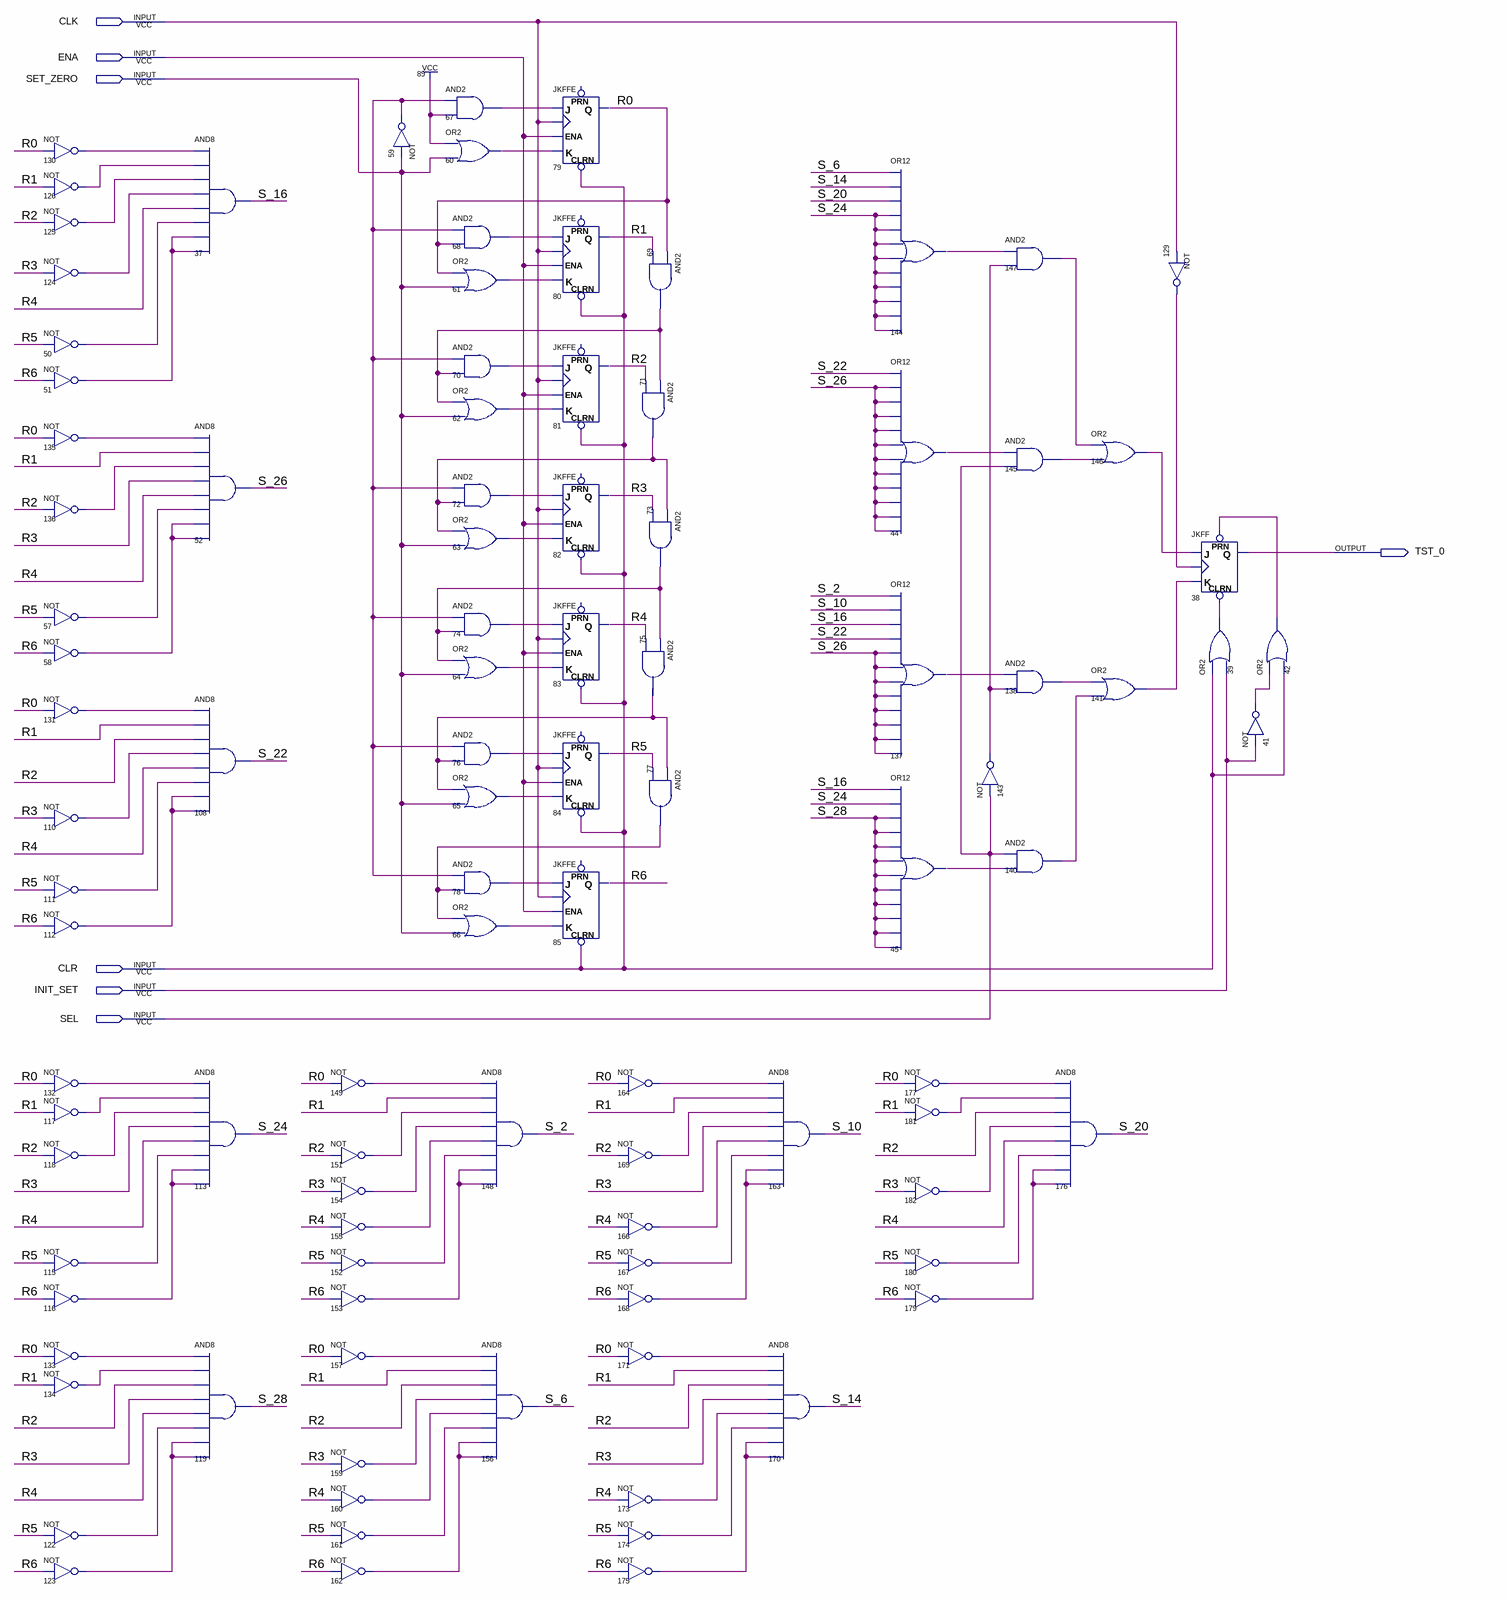
[diagram p0: schematic sheet]
// Quartus schematic test_seq2.bdf as structural Verilog: 101 symbols, 7 pins
module test_seq2 (
  input  CLK,
  input  ENA,
  input  SET_ZERO,
  input  CLR,
  input  INIT_SET,
  input  SEL,
  output TST_0
);

  wire n39_out, n41_out, n42_out, n44_out, n45_out, n50_out, n51_out, n57_out, n58_out, n59_out, n60_out,
       n61_out, n62_out, n63_out, n64_out, n65_out, n66_out, n67_out, n68_out, n69_out, n70_out, n71_out,
       n72_out, n73_out, n74_out, n75_out, n76_out, n77_out, n78_out, n110_out, n111_out, n112_out, n115_out,
       n116_out, n117_out, n118_out, n122_out, n123_out, n124_out, n125_out, n126_out, n129_out, n130_out,
       n131_out, n132_out, n133_out, n134_out, n135_out, n136_out, n137_out, n138_out, n140_out, n141_out,
       n143_out, n144_out, n145_out, n146_out, n147_out, n149_out, n151_out, n152_out, n153_out, n154_out,
       n155_out, n157_out, n159_out, n160_out, n161_out, n162_out, n164_out, n166_out, n167_out, n168_out,
       n169_out, n171_out, n173_out, n174_out, n175_out, n177_out, n179_out, n180_out, n181_out, n182_out,
       R0, R1, R2, R3, R4, R5, R6, S_2, S_6, S_10, S_14, S_16, S_20, S_22, S_24, S_26, S_28;

  not u_130 (n130_out, R0);
  not u_126 (n126_out, R1);
  not u_125 (n125_out, R2);
  not u_124 (n124_out, R3);
  not u_50 (n50_out, R5);
  not u_51 (n51_out, R6);
  not u_135 (n135_out, R0);
  not u_136 (n136_out, R2);
  not u_57 (n57_out, R5);
  not u_58 (n58_out, R6);
  not u_131 (n131_out, R0);
  not u_110 (n110_out, R3);
  not u_111 (n111_out, R5);
  not u_112 (n112_out, R6);
  not u_132 (n132_out, R0);
  not u_117 (n117_out, R1);
  not u_118 (n118_out, R2);
  not u_115 (n115_out, R5);
  not u_116 (n116_out, R6);
  not u_133 (n133_out, R0);
  not u_134 (n134_out, R1);
  not u_122 (n122_out, R5);
  not u_123 (n123_out, R6);
  and u_37 (S_16, n130_out, n126_out, n125_out, n124_out, R4, n50_out, n51_out, n51_out);
  and u_52 (S_26, n135_out, R1, n136_out, R3, R4, n57_out, n58_out, n58_out);
  and u_108 (S_22, n131_out, R1, R2, n110_out, R4, n111_out, n112_out, n112_out);
  and u_113 (S_24, n132_out, n117_out, n118_out, R3, R4, n115_out, n116_out, n116_out);
  and u_119 (S_28, n133_out, n134_out, R2, R3, R4, n122_out, n123_out, n123_out);
  not u_149 (n149_out, R0);
  not u_151 (n151_out, R2);
  not u_154 (n154_out, R3);
  not u_155 (n155_out, R4);
  not u_152 (n152_out, R5);
  not u_153 (n153_out, R6);
  not u_157 (n157_out, R0);
  not u_159 (n159_out, R3);
  not u_160 (n160_out, R4);
  not u_161 (n161_out, R5);
  not u_162 (n162_out, R6);
  not u_59 (n59_out, SET_ZERO);
  and u_67 (n67_out, n59_out, 1'b1);
  or u_60 (n60_out, 1'b1, SET_ZERO);
  and u_68 (n68_out, n59_out, R0);
  or u_61 (n61_out, R0, SET_ZERO);
  and u_70 (n70_out, n59_out, n69_out);
  or u_62 (n62_out, n69_out, SET_ZERO);
  and u_72 (n72_out, n59_out, n71_out);
  or u_63 (n63_out, n71_out, SET_ZERO);
  and u_74 (n74_out, n59_out, n73_out);
  or u_64 (n64_out, n73_out, SET_ZERO);
  and u_76 (n76_out, n59_out, n75_out);
  or u_65 (n65_out, n75_out, SET_ZERO);
  and u_78 (n78_out, n59_out, n77_out);
  or u_66 (n66_out, n77_out, SET_ZERO);
  and u_148 (S_2, n149_out, R1, n151_out, n154_out, n155_out, n152_out, n153_out, n153_out);
  and u_156 (S_6, n157_out, R1, R2, n159_out, n160_out, n161_out, n162_out, n162_out);
  JKFFE u_79 (.J(n67_out), .CLK(CLK), .CLRN(CLR), .K(n60_out), .ENA(ENA), .Q(R0));  // open: PRN
  JKFFE u_80 (.J(n68_out), .CLK(CLK), .CLRN(CLR), .K(n61_out), .ENA(ENA), .Q(R1));  // open: PRN
  JKFFE u_81 (.J(n70_out), .CLK(CLK), .CLRN(CLR), .K(n62_out), .ENA(ENA), .Q(R2));  // open: PRN
  JKFFE u_82 (.J(n72_out), .CLK(CLK), .CLRN(CLR), .K(n63_out), .ENA(ENA), .Q(R3));  // open: PRN
  JKFFE u_83 (.J(n74_out), .CLK(CLK), .CLRN(CLR), .K(n64_out), .ENA(ENA), .Q(R4));  // open: PRN
  JKFFE u_84 (.J(n76_out), .CLK(CLK), .CLRN(CLR), .K(n65_out), .ENA(ENA), .Q(R5));  // open: PRN
  JKFFE u_85 (.J(n78_out), .CLK(CLK), .CLRN(CLR), .K(n66_out), .ENA(ENA), .Q(R6));  // open: PRN
  not u_164 (n164_out, R0);
  not u_169 (n169_out, R2);
  not u_166 (n166_out, R4);
  not u_167 (n167_out, R5);
  not u_168 (n168_out, R6);
  not u_171 (n171_out, R0);
  not u_173 (n173_out, R4);
  not u_174 (n174_out, R5);
  not u_175 (n175_out, R6);
  and u_69 (n69_out, R0, R1);
  and u_71 (n71_out, n69_out, R2);
  and u_73 (n73_out, n71_out, R3);
  and u_75 (n75_out, n73_out, R4);
  and u_77 (n77_out, n75_out, R5);
  and u_163 (S_10, n164_out, R1, n169_out, R3, n166_out, n167_out, n168_out, n168_out);
  and u_170 (S_14, n171_out, R1, R2, R3, n173_out, n174_out, n175_out, n175_out);
  or u_144 (n144_out, S_6, S_14, S_20, S_24, S_24, S_24, S_24, S_24, S_24, S_24, S_24, S_24);
  or u_44 (n44_out, S_22, S_26, S_26, S_26, S_26, S_26, S_26, S_26, S_26, S_26, S_26, S_26);
  or u_137 (n137_out, S_2, S_10, S_16, S_22, S_26, S_26, S_26, S_26, S_26, S_26, S_26, S_26);
  or u_45 (n45_out, S_16, S_24, S_28, S_28, S_28, S_28, S_28, S_28, S_28, S_28, S_28, S_28);
  not u_177 (n177_out, R0);
  not u_181 (n181_out, R1);
  not u_182 (n182_out, R3);
  not u_180 (n180_out, R5);
  not u_179 (n179_out, R6);
  and u_147 (n147_out, n144_out, n143_out);
  and u_145 (n145_out, n44_out, SEL);
  and u_138 (n138_out, n137_out, n143_out);
  not u_143 (n143_out, SEL);
  and u_140 (n140_out, SEL, n45_out);
  and u_176 (S_20, n177_out, n181_out, R2, n182_out, R4, n180_out, n179_out, n179_out);
  or u_146 (n146_out, n147_out, n145_out);
  or u_141 (n141_out, n138_out, n140_out);
  not u_129 (n129_out, CLK);
  JKFF u_38 (.PRN(n42_out), .CLRN(n39_out), .K(n141_out), .J(n146_out), .CLK(n129_out), .Q(TST_0));
  or u_39 (n39_out, CLR, INIT_SET);
  or u_42 (n42_out, n41_out, CLR);
  not u_41 (n41_out, INIT_SET);
endmodule
